# Altium schematic sheet S05.SchDoc: IEEE-1394/Ethernet FPGA Controller
size 381 x 254 mm; Revision: 2.1; SheetNumber: 5; SheetTotal: 6
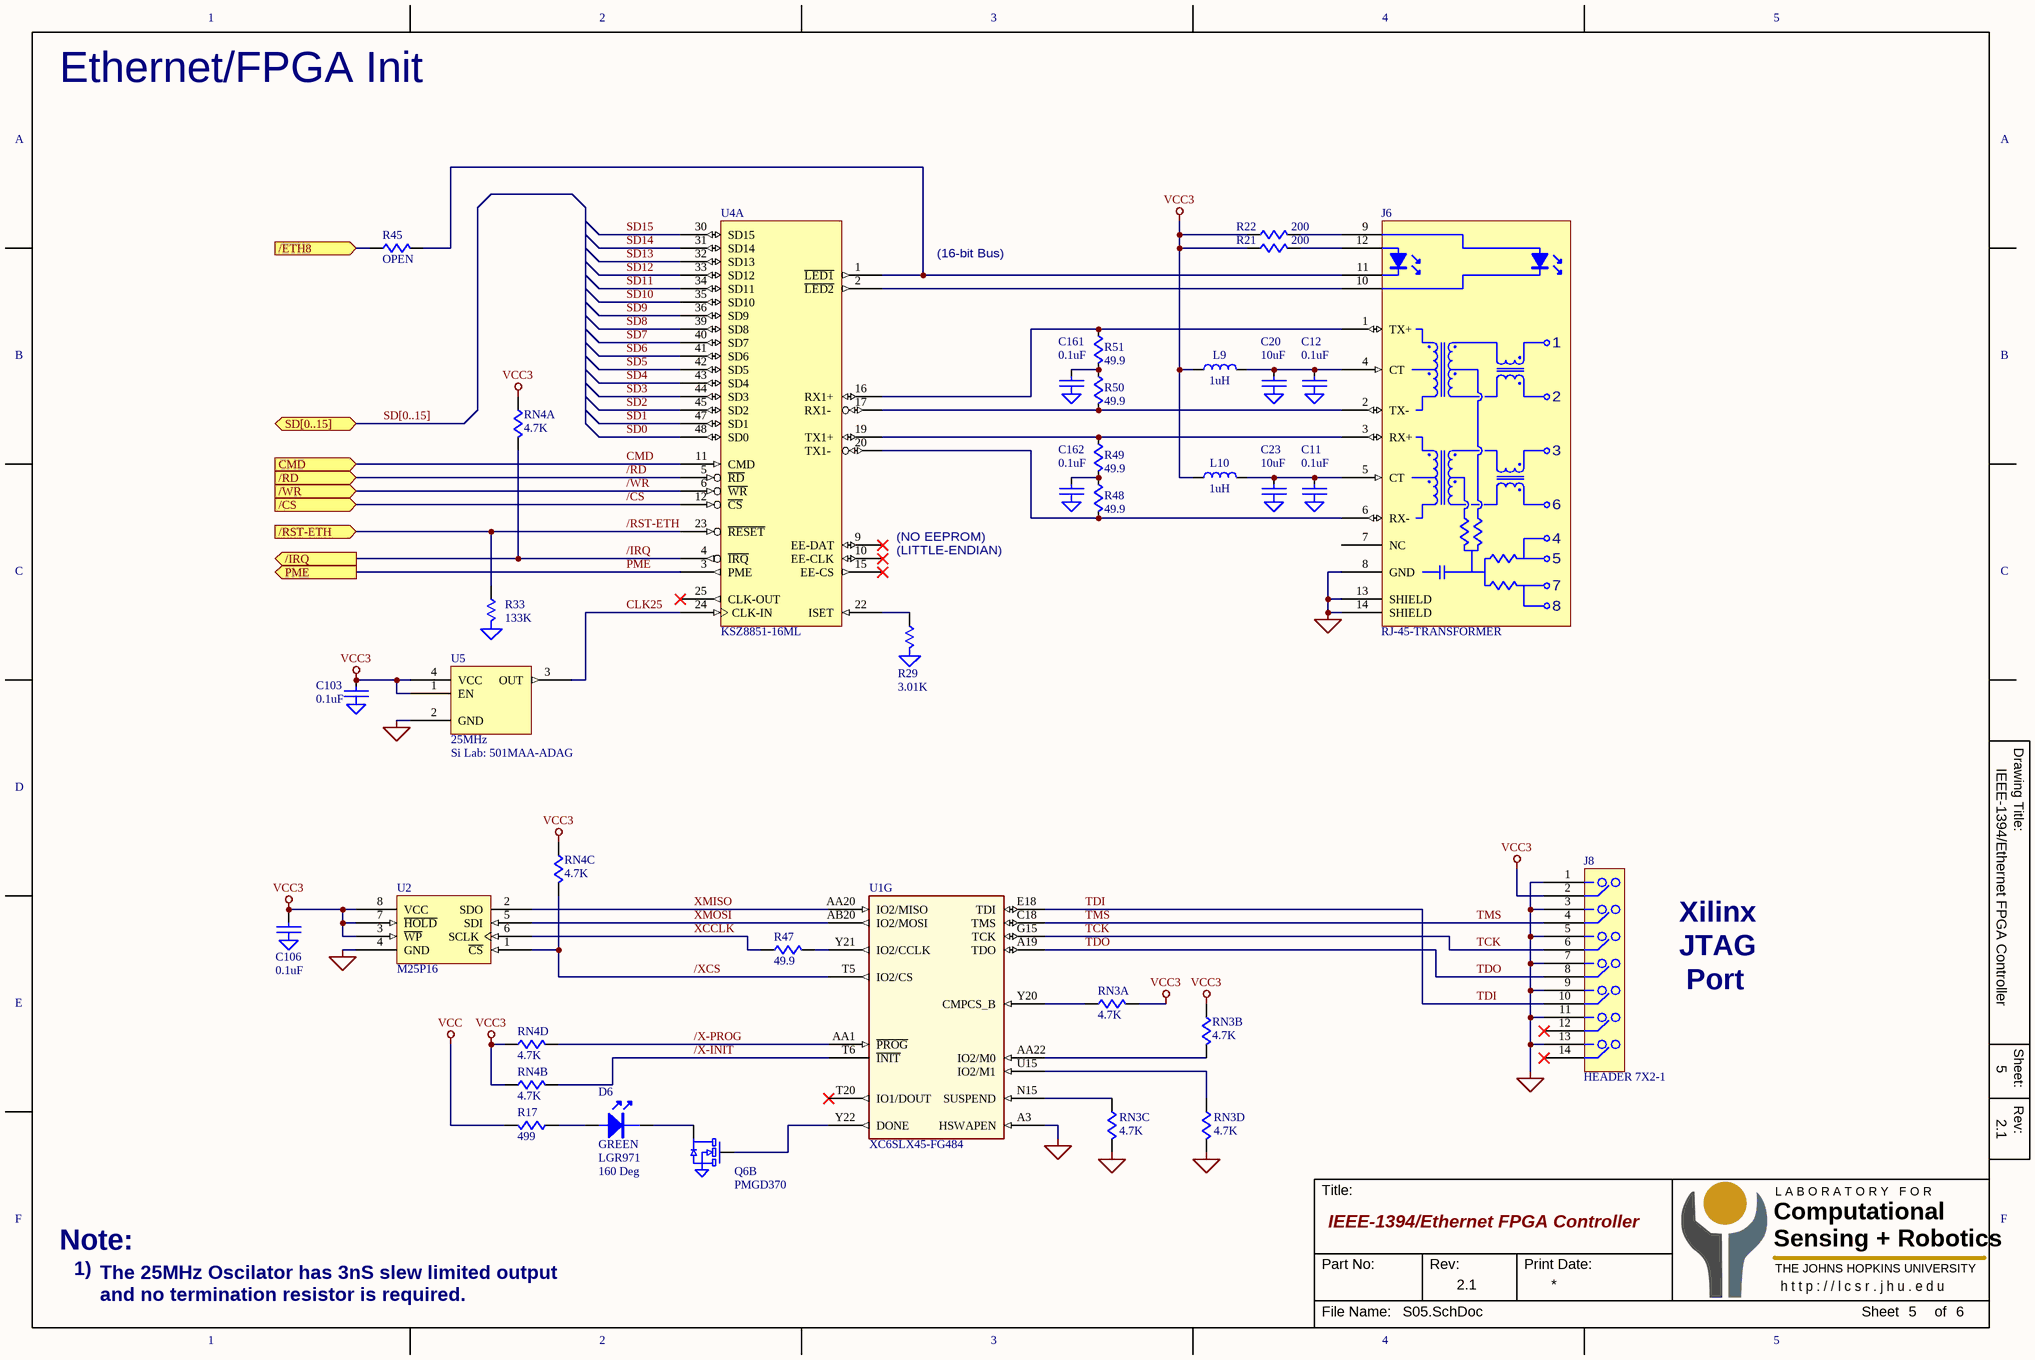
[diagram p0: S05.SchDoc]

## Parts
C11  0.1uF  [C0603]
C12  0.1uF  [C0603]
C20  10uF  [C0603]
C23  10uF  [C0603]
C103  0.1uF  [C0402]
C106  0.1uF  [C0402]
C161  0.1uF  [C0402]
C162  0.1uF  [C0402]
D6  Color: GREEN  P/N: LGR971  Angle: 160 Deg  [LED-0805]  (hidden comment: LED)
J6  RJ-45-TRANSFORMER  [RJ-45-TRANS]
J8  HEADER 7X2-1  [HDR-7x2-2MM]
L9  1uH  [L0603]
L10  1uH  [L0603]
Q6  PMGD370  [SC70-6]  (part B of 2)
R17  499  [R0603]
R21  200  [R0603]
R22  200  [R0603]
R29  3.01K  [R0603]
R33  133K  [R0603]
R45  OPEN  [R0603]
R47  49.9  [R0402]
R48  49.9  [R0402]
R49  49.9  [R0402]
R50  49.9  [R0402]
R51  49.9  [R0402]
RN3  4.7K  [RN-742C083]  (parts A,B,C,D of 4)
RN4  4.7K  [RN-742C083]  (parts A,B,C,D of 4)
U1  XC6SLX45-FG484  [FG-484]  (part G of 8)
U2  M25P16  [SO-8]
U4  KSZ8851-16ML  [QFP-48-7MM]  (part A of 2)
U5  25MHz  [OSC-2x2.5mm]

## Ports
/CS (in), /ETH8 (in), /IRQ (out), /RD (in), /RST-ETH (in), /WR (in), CMD (in), PME (out), SD[0..15] (bidir)

## Nets
GND: C11.2(GND) C12.2(GND) C20.2(GND) C23.2(GND) C103.2(GND) C106.2(GND) C161.2(GND) C162.2(GND) J6.8(GND) J6.13(SHIELD) J6.14(SHIELD) J8.1 J8.3 J8.5 J8.7 J8.9 J8.11 J8.13 Q6.4(S2) R29.2(GND) R33.2(GND) RN3.5 RN3.6 U1.A3(HSWAPEN) U2.4(GND) U5.2(GND)
VCC: R17.2
VCC3: C103.1 C106.1 J8.2 L9.1 L10.1 R21.1 R22.1 RN3.1 RN3.2 RN4.1 RN4.2 RN4.3 RN4.4 U2.3(~{WP}) U2.7(~{HOLD}) U2.8(VCC) U5.1(EN) U5.4(VCC)
/CS: U4.12(~{CS}) ; port /CS
/ETH8: R45.1 ; port /ETH8
/IRQ: RN4.8 U4.4(~{IRQ}) ; port /IRQ
/RD: U4.5(~{RD}) ; port /RD
/RST-ETH: R33.1 U4.23(~{RESET}) ; port /RST-ETH
/WR: U4.6(~{WR}) ; port /WR
/X-INIT: RN4.7 U1.T6(~{INIT})
/X-PROG: RN4.5 U1.AA1(~{PROG})
/XCS: RN4.6 U1.T5(IO2/CS) U2.1(~{CS})
CLK25: U4.24(CLK-IN) U5.3(OUT)
CMD: U4.11(CMD) ; port CMD
PME: U4.3(PME) ; port PME
SD0: U4.48(SD0)
SD1: U4.47(SD1)
SD2: U4.45(SD2)
SD3: U4.44(SD3)
SD4: U4.43(SD4)
SD5: U4.42(SD5)
SD6: U4.41(SD6)
SD7: U4.40(SD7)
SD8: U4.39(SD8)
SD9: U4.36(SD9)
SD10: U4.35(SD10)
SD11: U4.34(SD11)
SD12: U4.33(SD12)
SD13: U4.32(SD13)
SD14: U4.31(SD14)
SD15: U4.30(SD15)
TCK: J8.6 U1.G15(TCK)
TDI: J8.10 U1.E18(TDI)
TDO: J8.8 U1.A19(TDO)
TMS: J8.4 U1.C18(TMS)
XCCLK: R47.1 U2.6(SCLK)
XMISO: U1.AA20(IO2/MISO) U2.2(SDO)
XMOSI: U1.AB20(IO2/MOSI) U2.5(SDI)
NetC11_1: C11.1 C23.1 J6.5(CT) L10.2
NetC12_1: C12.1 C20.1 J6.4(CT) L9.2
NetC161_1: C161.1 R50.1 R51.2
NetC162_1: C162.1 R48.1 R49.2
NetD6_1: D6.1(C) Q6.3(D2)
NetD6_2: D6.2(A) R17.1
NetJ6_1: J6.1(TX+) R51.1 U4.16(RX1+)
NetJ6_2: J6.2(TX-) R50.2 U4.17(RX1-)
NetJ6_3: J6.3(RX+) R49.1 U4.19(TX1+)
NetJ6_6: J6.6(RX-) R48.2 U4.20(TX1-)
NetJ6_9: J6.9(A) R22.2
NetJ6_10: J6.10(K) U4.2(~{LED2})
NetJ6_11: J6.11(K) R45.2 U4.1(~{LED1})
NetJ6_12: J6.12(A) R21.2
NetQ6_5: Q6.5(G2) U1.Y22(DONE)
NetR29_1: R29.1 U4.22(ISET)
NetR47_2: R47.2 U1.Y21(IO2/CCLK)
NetRN3_3: RN3.3 U1.N15(SUSPEND)
NetRN3_4: RN3.4 U1.U15(IO2/M1)
NetRN3_7: RN3.7 U1.AA22(IO2/M0)
NetRN3_8: RN3.8 U1.Y20(CMPCS_B)

Not connected (* = marked no-connect by the designer): J6 7(NC); J8 12* 14*; U1 T20(IO1/DOUT)*; U4 9(EE-DAT)* 10(EE-CLK)* 15(EE-CS)* 25(CLK-OUT)*

## Buses and harness runs
bus SD[0..15] = port SD[0..15]

## Notes on the sheet
- Ethernet/FPGA Init
- (16-bit Bus)
- (LITTLE-ENDIAN)
- (NO EEPROM)
- Xilinx
- JTAG
- Port
- Note:
- 1)
- The 25MHz Oscilator has 3nS slew limited output and no termination resistor is required.
- 1
- 2
- 3
- 4
- 5
- A
- B
- C
- Drawing Title:
- D
- E
- Sheet:
- Rev:
- F
- Title:
- Computational
- Sensing + Robotics
- L A B O R A T O R Y   F O R
- Part No:
- Print Date:
- THE JOHNS HOPKINS UNIVERSITY
- h t t p : / / l c s r . j h u . e d u
- File Name:
- Sheet
- of
- (in symbol OSCILATOR) Si Lab: 501MAA-ADAG

## Library data of the parts
C11 C12 C20 C23 C103 C106 C161 C162 = CAP-GND
L9 L10 = INDUCTOR
Q6 = MOSFET-N-DUAL6
R17 R21 R22 R45 R47-R51 = R
R29 R33 = R-GND
RN3 RN4 = RN-DISC-SM-4X
U2 = 25AA128
U5 = OSCILATOR